# EAGLE design Croduino Nova v2.0 (EAGLE 7.3.0)

## Sheet 1 of 2
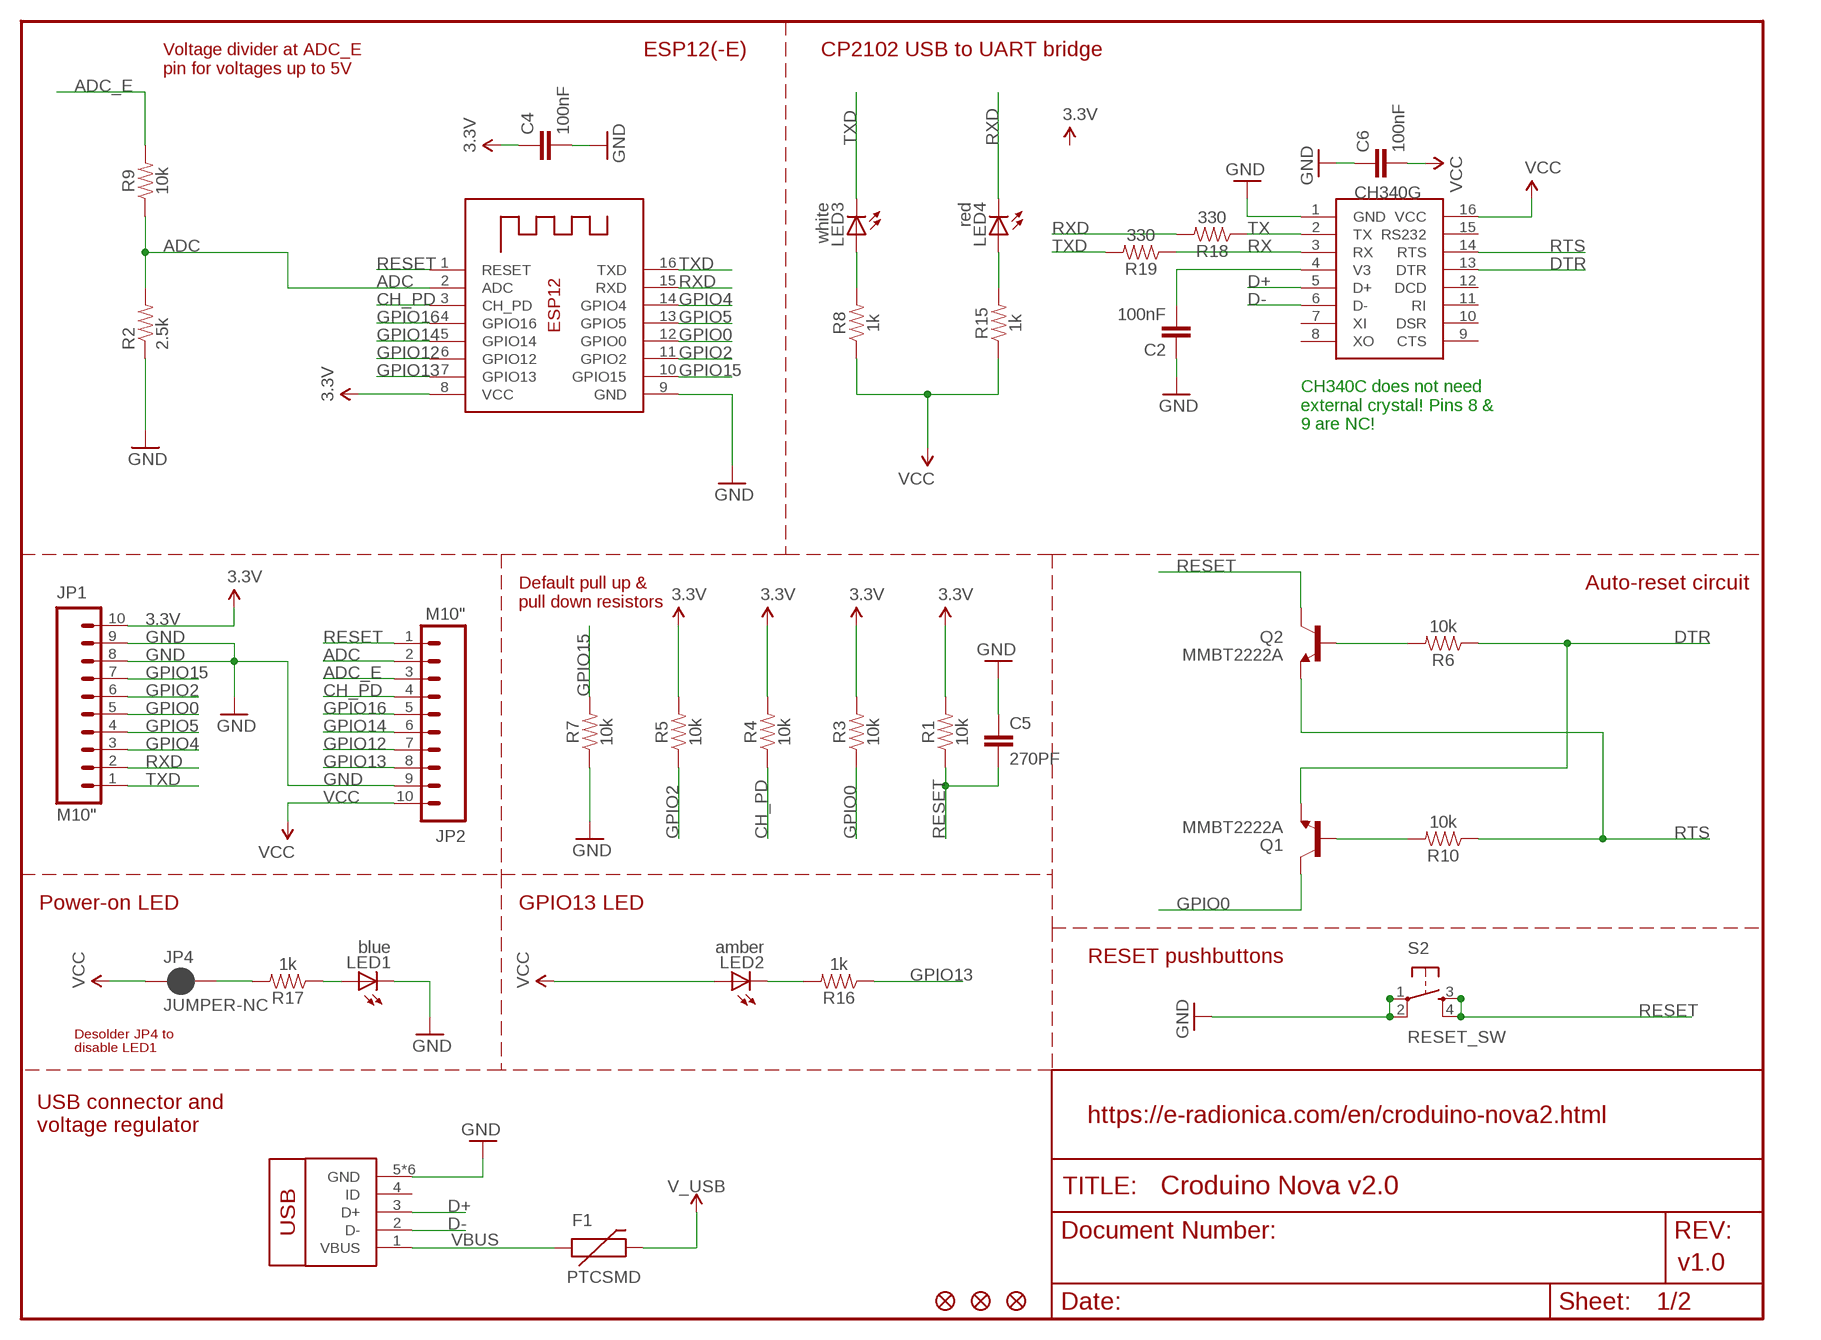
[diagram p0: schematic, sheet 1]

### Parts
C2  100nF  CAP0603-CAP  [0603-CAP]
C4  100nF  CAP0603-CAP  [0603-CAP]
C5  270PF  270PF-0603-50V-5%  [0603]
C6  100nF  CAP0603-CAP  [0603-CAP]
F1  PTCSMD  [PTC-1206]
JP1  M10"  [1X10]
JP2  M10"  [1X10]
JP3  FIDUCIAL1X2  [FIDUCIAL-1X2]
JP4  JUMPER-NC  JUMPER-SMT_2_NC_PASTE_NO-SILK  [SMT-JUMPER_2_NC_PASTE_NO-SILK]
JP5  FIDUCIAL1X2  [FIDUCIAL-1X2]
JP6  FIDUCIAL1X2  [FIDUCIAL-1X2]
LED1  blue  LEDCHIP-LED0805  [CHIP-LED0805]
LED2  amber  LEDCHIP-LED0805  [CHIP-LED0805]
LED3  white  LEDCHIP-LED0805  [CHIP-LED0805]
LED4  red  LEDCHIP-LED0805  [CHIP-LED0805]
Q1  MMBT2222A  TRANSISTOR_NPNSOT23-3  [SOT23-3]
Q2  MMBT2222A  TRANSISTOR_NPNSOT23-3  [SOT23-3]
R1  10k  10KOHM-0603-1/10W-1%  [0603]
R2  2.5k  RESISTOR0603-RES  [0603-RES]
R3  10k  10KOHM-0603-1/10W-1%  [0603]
R4  10k  10KOHM-0603-1/10W-1%  [0603]
R5  10k  10KOHM-0603-1/10W-1%  [0603]
R6  10k  10KOHM-0603-1/10W-1%  [0603]
R7  10k  10KOHM-0603-1/10W-1%  [0603]
R8  1k  1KOHM-0603-1/10W-1%  [0603]
R9  10k  10KOHM-0603-1/10W-1%  [0603]
R10  10k  10KOHM-0603-1/10W-1%  [0603]
R15  1k  1KOHM-0603-1/10W-1%  [0603]
R16  1k  1KOHM-0603-1/10W-1%  [0603]
R17  1k  1KOHM-0603-1/10W-1%  [0603]
R18  330  1KOHM-0603-1/10W-1%  [0603]
R19  330  1KOHM-0603-1/10W-1%  [0603]
S2  RESET_SW  TAC_SWITCHSMD  [TACTILE_SWITCH_SMD]
U$8  USB-MICRO  [U-F-M5DD-Y-L]
U$10  CH340C  CH340G  [SOIC16]
X1  ESP8266-12  ESP-12  [ESP-12]

### Nets
3.3V: C4.1 JP1.10 R1.2 R3.2 R4.2 R5.2 X1.8(VCC) ; also sheet 2
ADC: JP2.2 R2.2 R9.1 X1.2(ADC)
ADC_E: JP2.3 R9.2
CH_PD: JP2.4 R4.1 X1.3(CH_PD)
D+: U$8.3(D+) U$10.5(D+)
D-: U$8.2(D-) U$10.6(D-)
DTR: Q1.2(E) R6.1 U$10.13(DTR)
GND: C2.1 C4.2 C5.1 C6.1 JP1.8 JP1.9 JP2.9 LED1.C R2.1 R7.1 S2.1 S2.2 U$8.5(GND) U$8.PAD(GND) U$8.SHIELD1(GND) U$8.SHIELD2(GND) U$8.SHIELD3(GND) U$8.SHIELD4(GND) U$10.1(GND) X1.9(GND) ; also sheet 2
GPIO0: JP1.5 Q1.3(C) R3.1 X1.12(GPIO0)
GPIO2: JP1.6 R5.1 X1.11(GPIO2)
GPIO4: JP1.3 X1.14(GPIO4) ; also sheet 2
GPIO5: JP1.4 X1.13(GPIO5) ; also sheet 2
GPIO12: JP2.7 X1.6(GPIO12)
GPIO13: JP2.8 R16.1 X1.7(GPIO13)
GPIO14: JP2.6 X1.5(GPIO14)
GPIO15: JP1.7 R7.2 X1.10(GPIO15)
GPIO16: JP2.5 X1.4(GPIO16)
N$1: LED3.A R8.2
N$2: JP4.2 R17.2
N$3: LED1.A R17.1
N$4: LED4.A R15.2
N$5: LED2.C R16.2
N$7: C2.2 U$10.4(V3)
N$8: Q1.1(B) R10.2
N$11: Q2.1(B) R6.2
RESET: C5.2 JP2.1 Q2.3(C) R1.1 S2.3 S2.4 X1.1(RESET)
RTS: Q2.2(E) R10.1 U$10.14(RTS)
RX: R19.1 U$10.3(RX)
RXD: JP1.2 LED4.C R18.2 X1.15(RXD)
TX: R18.1 U$10.2(TX)
TXD: JP1.1 LED3.C R19.2 X1.16(TXD)
V_USB: F1.2 ; also sheet 2
VBUS: F1.1 U$8.1(VBUS)
VCC: C6.2 JP2.10 JP4.1 LED2.A R8.1 R15.1 U$10.16(VCC) ; also sheet 2
Unconnected: U$8.4(ID) U$10.7(XI) U$10.8(XO) U$10.9(CTS) U$10.10(DSR) U$10.11(RI) U$10.12(DCD) U$10.15(RS232)

### Notes on the sheet
- ESP12(-E) | CP2102 USB to UART bridge
- Voltage divider at ADC_E
  pin for voltages up to 5V
- CH340C does not need
  external crystal! Pins 8 &
  9 are NC!
- Auto-reset circuit
- Default pull up &
  pull down resistors
- Power-on LED | GPIO13 LED
- RESET pushbuttons
- Desolder JP4 to 
  disable LED1
- https://e-radionica.com/en/croduino-nova2.html
- USB connector and 
  voltage regulator
- v1.0

## Sheet 2 of 2
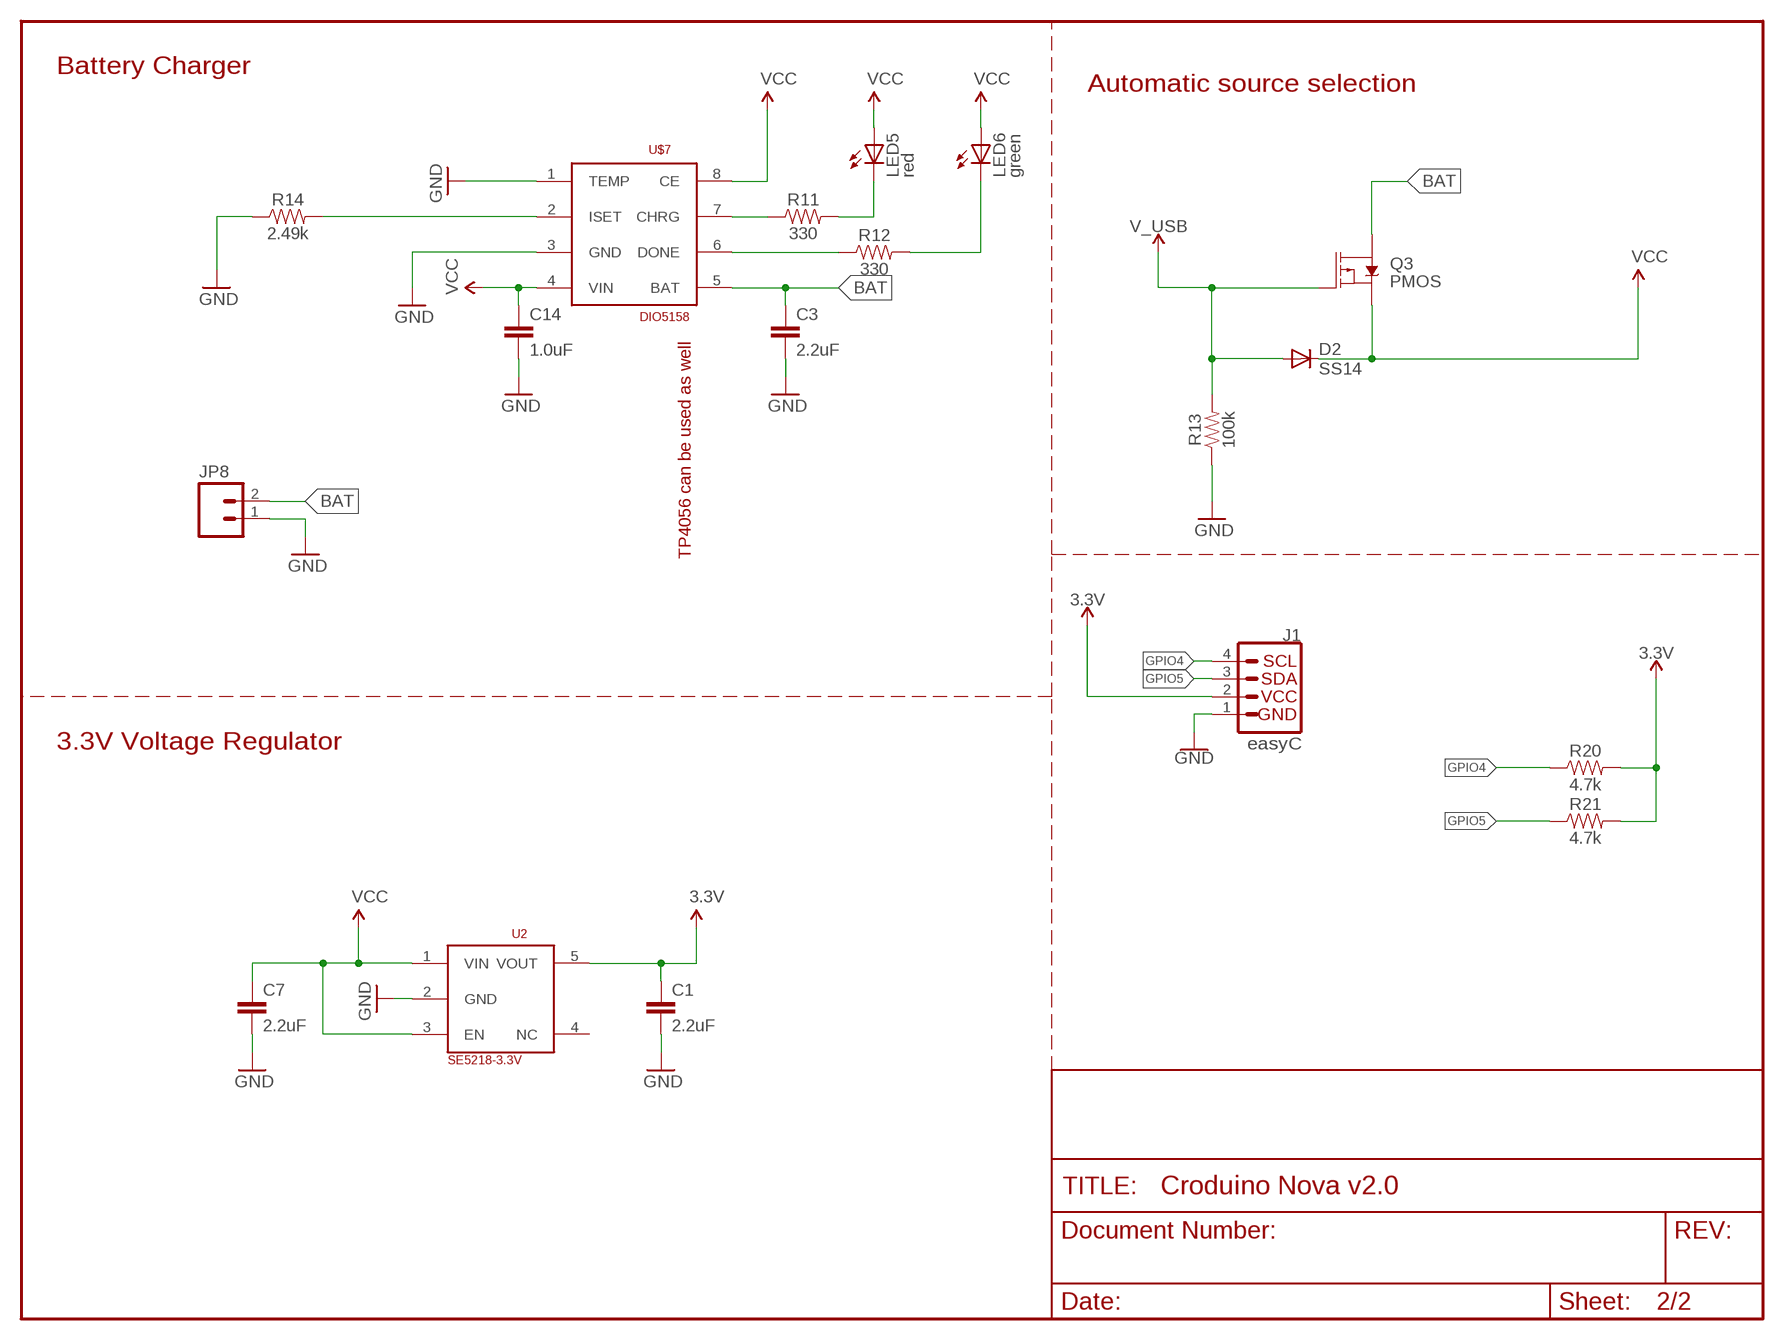
[diagram p1: schematic, sheet 2]

### Parts
C1  2.2uF  2.2UF-0603-10V-20%  [0603]
C3  2.2uF  2.2UF-0603-10V-20%  [0603]
C7  2.2uF  2.2UF-0603-10V-20%  [0603]
C14  1.0uF  1.0UF-0603-16V-10%  [0603]
D2  SS14  DIODE-DO-214AC  [DO-214AC]
J1  QWIIC_CONNECTORJS-1MM  [1X04_1MM_RA]
JP8  M02-JST-2MM-SMT  [JST-2-SMD]
LED5  red  LEDCHIP-LED0805  [CHIP-LED0805]
LED6  green  LEDCHIP-LED0805  [CHIP-LED0805]
Q3  PMOS  MOSFET_PCH-IRLML2244  [SOT23-3]
R11  330  150OHM-0603-1/10W-1%  [0603]
R12  330  150OHM-0603-1/10W-1%  [0603]
R13  100k  100KOHM-0603-1/10W-1%  [0603]
R14  2.49k  4.7KOHM-0603-1/10W-1%  [0603]
R20  4.7k  4.7KOHM-0603-1/10W-1%  [0603]
R21  4.7k  4.7KOHM-0603-1/10W-1%  [0603]
U2  SE5218-3.3V  SE5218  [SOT23-5]
U$7  DIO5158  [SOIC-8]

### Nets
3.3V: C1.1 J1.2 R20.2 R21.2 U2.5(VOUT) ; also sheet 1
BAT: C3.1 JP8.2 Q3.3(D) U$7.5(BAT)
CHRG: R11.1 U$7.7(CHRG)
DONE: R12.1 U$7.6(DONE)
GND: C1.2 C3.2 C7.2 C14.2 J1.1 JP8.1 R13.1 R14.1 U2.2(GND) U$7.1(TEMP) U$7.3(GND) ; also sheet 1
GPIO4: J1.4 R20.1 ; also sheet 1
GPIO5: J1.3 R21.1 ; also sheet 1
ISET: R14.2 U$7.2(ISET)
LED1: LED5.C R11.2
LED2: LED6.C R12.2
V_USB: D2.A Q3.1(G) R13.2 ; also sheet 1
VCC: C7.1 C14.1 D2.C LED5.A LED6.A Q3.2(S) U2.1(VIN) U2.3(EN) U$7.4(VIN) U$7.8(CE) ; also sheet 1
Unconnected: U2.4(NC)

### Notes on the sheet
- Battery Charger
- Automatic source selection
- TP4056 can be used as well
- 3.3V Voltage Regulator | easyC

## Library data of the parts
C1 C3 C7 = SparkFun-Capacitors:2.2UF: 2.2µF ceramic capacitors A capacitor is a passive two-terminal electrical component used to store electrical energy temporarily in an electric field.; PROD_ID: CAP-07888
C2 C4 C6 = SparkFun:CAP: Capacitor Standard 0603 ceramic capacitor, and 0.1" leaded capacitor.
C5 = SparkFun-Capacitors:270PF: 270pF/0.27nF ceramic capacitors A capacitor is a passive two-terminal electrical component used to store electrical energy temporarily in an electric field.; PROD_ID: CAP-13339
C14 = SparkFun-Capacitors:1.0UF: 1µF ceramic capacitors A capacitor is a passive two-terminal electrical component used to store electrical energy temporarily in an electric field.; PROD_ID: CAP-00868
D2 = diode:DIODE-: DIODE
F1 = SparkFun:PTC: Resettable Fuse PTC Resettable Fuse. Spark Fun Electronics SKU : COM-08357
J1 = SparkFun-Connectors:QWIIC_CONNECTOR: SparkFun I2C Standard Qwiic Connector An SMD 1mm pitch JST connector makes it easy and quick (get it? Qwiic?) to connect I2C devices to each other. The Qwiic system <http://www.sparkfun.com/qwiic> enables fast and solderless connection between popular platforms and various sensors and actuators. We carry 200mm <https://www.sparkfun.com/products/14204>, 100mm <https://www.sparkfun.com/products/14205>, 50mm <https://www.sparkfun.com/products/14206>, and breadboard friendly <https://www.sparkfun.com/products/14207> Qwiic cables. We also offer 10 pcs strips <https://www.sparkfun.com/products/14323> the SMD connectors.; PROD_ID: CONN-13694
JP1 JP2 = SparkFun:M10: Header 10 Standard 10-pin 0.1" header. Use with straight break away headers (SKU : PRT-00116), right angle break away headers (PRT-00553), swiss pins (PRT-00743), machine pins (PRT-00117), and female headers (PRT-00115).
JP3 JP5 JP6 = SparkFun:FIDUCIAL: Fiducial Alignment Points Various fiducial points for machine vision alignment.
JP4 = SparkFun-Jumpers:JUMPER-SMT_2_NC_PASTE: Normally closed solder jumper This jumper has an aperture in the stencil to allow solder paste to bridge the split in the wire so it's normally closed (NC). Wick off the solder to open the connection. Reapply solder to reclose the connection.
JP8 = SparkFun:M02: Header 2 Standard 2-pin 0.1" header. Use with straight break away headers (SKU : PRT-00116), right angle break away headers (PRT-00553), swiss pins (PRT-00743), machine pins (PRT-00117), and female headers (PRT-00115). Molex polarized connector foot print use with SKU : PRT-08233 with associated crimp pins and housings.
LED1-LED6 = adafruit:LED: LED OSRAM: - CHIPLED LG R971, LG N971, LY N971, LG Q971, LY Q971, LO R971, LY R971 LH N974, LH R974 LS Q976, LO Q976, LY Q976 LO Q996 - Hyper CHIPLED LW Q18S LB Q993, LB Q99A, LB R99A - SideLED LS A670, LO A670, LY A670, LG A670, LP A670 LB A673, LV A673, LT A673, LW A673 LH A674 LY A675 LS A676, LA A676, LO A676, LY A676, LW A676 LS A679, LY A679, LG A679 - Hyper Micro SIDELED® LS Y876, LA Y876, LO Y876, LY Y876 LT Y87S - SmartLED LW L88C, LW L88S LB L89C, LB L89S, LG L890 LS L89K, LO L89K, LY L89K LS L896, LA L896, LO L896, LY L896 - TOPLED LS T670, LO T670, LY T670, LG T670, LP T670 LSG T670, LSP T670, LSY T670, LOP T670, LYG T670 LG T671, LOG T671, LSG T671 LB T673, LV T673, LT T673, LW T673 LH T674 LS T676, LA T676, LO T676, LY T676, LB T676, LH T676, LSB T676, LW T676 LB T67C, LV T67C, LT T67C, LS T67K, LO T67K, LY T67K, LW E67C LS E67B, LA E67B, LO E67B, LY E67B, LB E67C, LV E67C, LT E67C LW T67C LS T679, LY T679, LG T679 LS T770, LO T770, LY T770, LG T770, LP T770 LB T773, LV T773, LT T773, LW T773 LH T774 LS E675, LA E675, LY E675, LS T675 LS T776, LA T776, LO T776, LY T776, LB T776 LHGB T686 LT T68C, LB T68C - Hyper Mini TOPLED® LB M676 - Mini TOPLED Santana® LG M470 LS M47K, LO M47K, LY M47K Source: http://www.osram.convergy.de/
Q1 Q2 = SparkFun:TRANSISTOR_NPN: Transistor NPN BJT configuration in SOT23 package. MMBT2222 is the common NPN we use. Double check BCE configuration again layout.
Q3 = SparkFun-DiscreteSemi:MOSFET_PCH: P-channel MOSFETs Voltage controlled devices that allow control of high current outputs. SparkFun Products: SparkFun ESP32 Thing <https://www.sparkfun.com/products/13907> SparkFun ESP8266 Thing <https://www.sparkfun.com/products/13231>; PROD_ID: TRANS-11153; VALUE: 4.3A/20V/54mΩ
R1 R3-R7 R9 R10 = SparkFun-Resistors:10KOHM: 10kΩ resistor A resistor is a passive two-terminal electrical component that implements electrical resistance as a circuit element. Resistors act to reduce current flow, and, at the same time, act to lower voltage levels within circuits. - Wikipedia; PROD_ID: RES-00824
R2 = SparkFun:RESISTOR: Resistor Basic schematic elements and footprints for 0603, 1206, and PTH resistors.
R8 R15-R17 = SparkFun-Resistors:1KOHM: 1kΩ resistor A resistor is a passive two-terminal electrical component that implements electrical resistance as a circuit element. Resistors act to reduce current flow, and, at the same time, act to lower voltage levels within circuits. - Wikipedia; PROD_ID: RES-07856
R11 R12 = SparkFun-Resistors:150OHM: 150Ω resistor A resistor is a passive two-terminal electrical component that implements electrical resistance as a circuit element. Resistors act to reduce current flow, and, at the same time, act to lower voltage levels within circuits. - Wikipedia; PROD_ID: RES-11028; VALUE: 150
R13 = SparkFun-Resistors:100KOHM: 100kΩ resistor A resistor is a passive two-terminal electrical component that implements electrical resistance as a circuit element. Resistors act to reduce current flow, and, at the same time, act to lower voltage levels within circuits. - Wikipedia; PROD_ID: RES-07828
R14 = SparkFun-Resistors:4.7KOHM: 4.7kΩ resistor A resistor is a passive two-terminal electrical component that implements electrical resistance as a circuit element. Resistors act to reduce current flow, and, at the same time, act to lower voltage levels within circuits. - Wikipedia; PROD_ID: RES-07857; VALUE: 4.7k
R18 R19 = SparkFun-Resistors:1KOHM: 1kΩ resistor A resistor is a passive two-terminal electrical component that implements electrical resistance as a circuit element. Resistors act to reduce current flow, and, at the same time, act to lower voltage levels within circuits. - Wikipedia; PROD_ID: RES-07856; VALUE: 1k
R20 R21 = SparkFun-Resistors:4.7KOHM: 4.7kΩ resistor A resistor is a passive two-terminal electrical component that implements electrical resistance as a circuit element. Resistors act to reduce current flow, and, at the same time, act to lower voltage levels within circuits. - Wikipedia; PROD_ID: RES-07857
S2 = SparkFun:TAC_SWITCH: Momentary Switch Button commonly used for reset or general input. Spark Fun Electronics SKU : COM-00097
U2 = ERADIONICA:SE5218
U$7 = ERADIONICA:DIO5158
U$8 = ERADIONICA:USB-MICRO
U$10 = ch340g:CH340G
X1 = adafruit:ESP-12

## Board
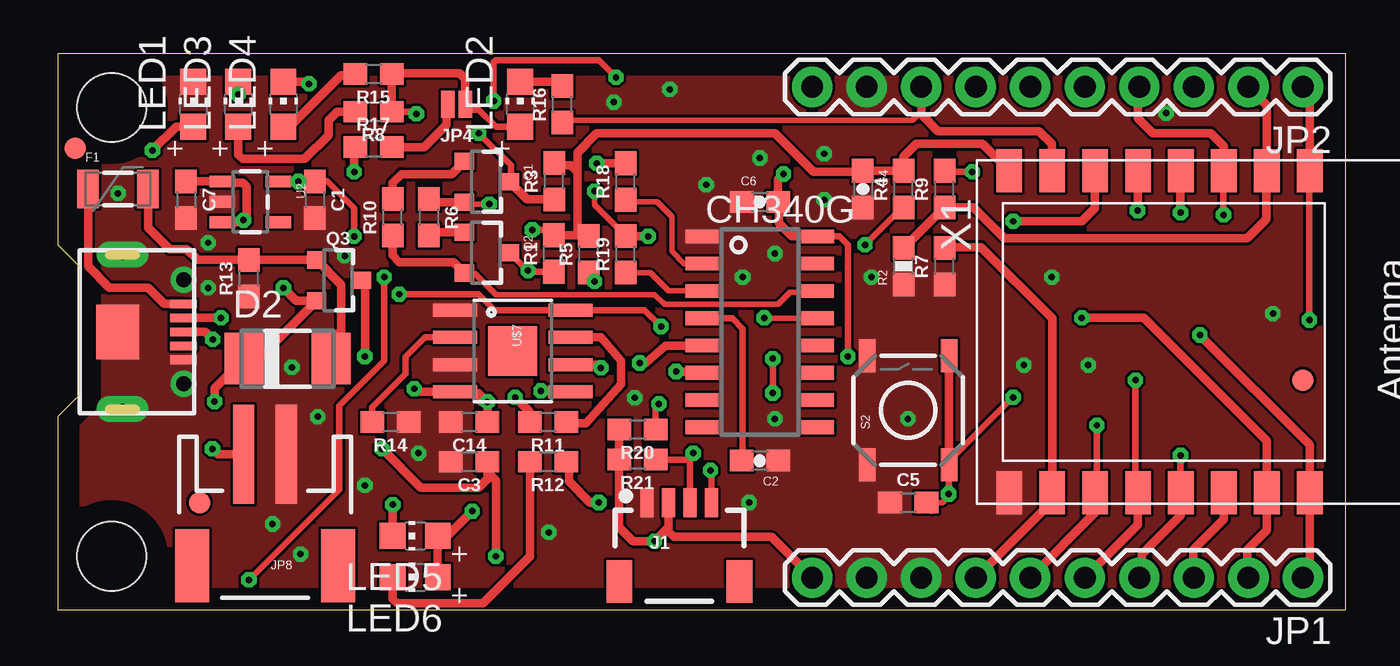
[diagram p2: board, top side]
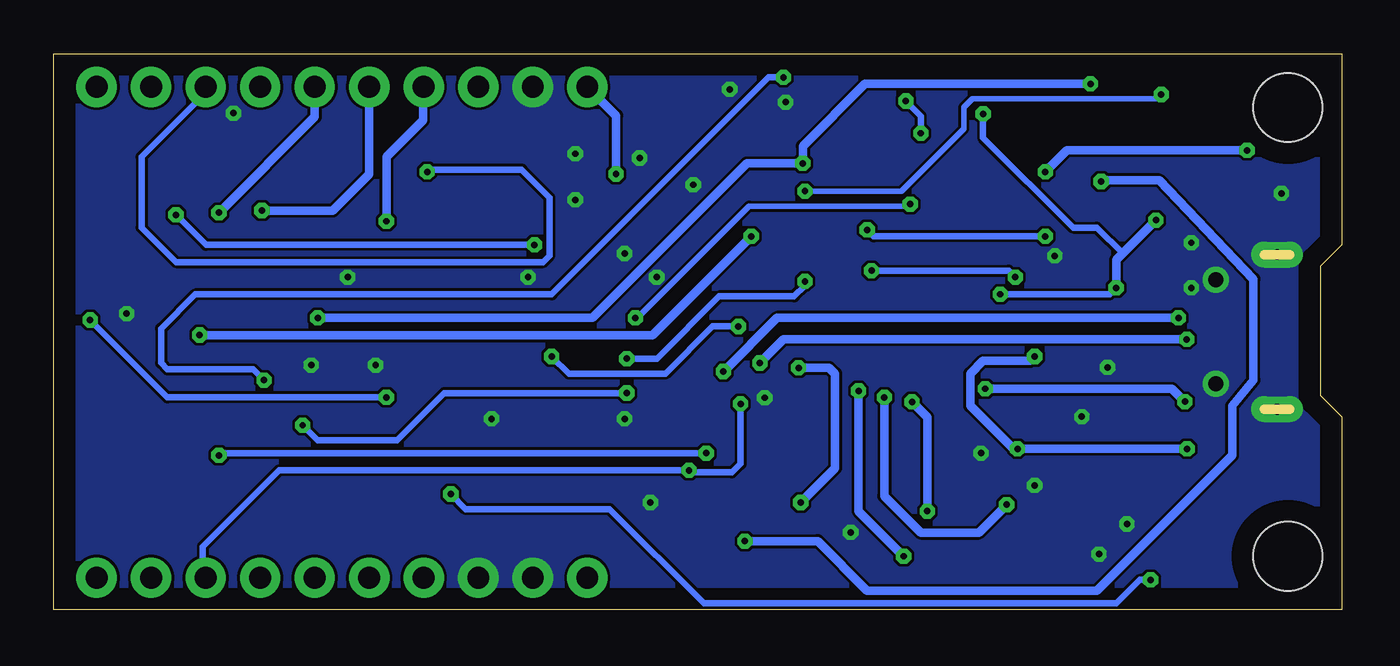
[diagram p3: board, bottom side, seen from below]

Size 60 x 25.9 mm. Coordinates in mm from the lower left corner, seen from the top.
Outline: 0,0 60,0 60,25.9 0,25.9 0,17 1,16 1,10 0,9 0,0
Copper layers (1*16): Top 0.035mm / dielectric 1.5mm / Bottom 0.035mm
Design rules "default *": minimum track width 10mil, minimum drill 24mil, track to track 5mil, track to pad 5mil, pad to pad 5mil, via to via 5mil, smd to smd 0mil, copper to edge 40mil, drill to drill 8mil, minimum pad ring 10mil, minimum via ring 8mil, stop-mask expansion 4mil, vias tented up to drill 0.6mm, thermal gap 10mil
Holes 3.2 mm at 2.5,23.4 2.5,2.5

### Footprints (pad centres in the part's own frame; a part is rotated, then mirrored left to right if it is on the bottom)
0603 = smd 1.1 x 1: 1 -0.85,0; 2 0.85,0
0603-CAP = smd 1.1 x 1: 1 -0.85,0; 2 0.85,0
DO-214AC = smd 1.8 x 2.4: A 2.025,0; C -2.025,0
PTC-1206 = smd 1 x 1.8: 1 -1.4,0; 2 1.4,0
1X04_1MM_RA = smd 0.6 x 1.35: 1 -1.5,0; 2 -0.5,0; 3 0.5,0; 4 1.5,0 | smd 1.2 x 2: NC1 2.8,-3.675; NC2 -2.8,-3.675
1X10 = drill 1.016 pad 1.88: 1 0,0; 2 2.54,0; 3 5.08,0; 4 7.62,0; 5 10.16,0; 6 12.7,0; 7 15.24,0; 8 17.78,0; 9 20.32,0; 10 22.86,0
FIDUCIAL-1X2 = smd 1 x 1: 1 0,0
SMT-JUMPER_2_NC_PASTE_NO-SILK = smd 0.635 x 1.27: 1 -0.406,0; 2 0.406,0
JST-2-SMD = smd 1 x 4.6: 1 -1,-3.7; 2 1,-3.7 | smd 1.6 x 3.4: NC1 -3.4,1.5; NC2 3.4,1.5
CHIP-LED0805 = smd 1.2 x 1.2: A 0,-1.05; C 0,1.05
SOT23-3 = smd 0.8 x 0.9: 1 -0.95,-1; 2 0.95,-1; 3 0,1.1
0603-RES = smd 1.1 x 1: 1 -0.85,0; 2 0.85,0
TACTILE_SWITCH_SMD = smd 1.524 x 0.762: 1 -2.54,1.905; 2 2.54,1.905; 3 -2.54,-1.905; 4 2.54,-1.905
SOT23-5 = smd 0.55 x 1.2: 1 -0.95,-1.3; 2 0,-1.3; 3 0.95,-1.3; 4 0.95,1.3; 5 -0.95,1.3
SOIC-8 = smd 0.61 x 2.057: 1 -2.07,-2.892; 2 -0.8,-2.892; 3 0.47,-2.892; 4 1.74,-2.892; 5 1.74,2.492; 6 0.47,2.492; 7 -0.8,2.492; 8 -2.07,2.492 | smd 2.286 x 2.286: EPAD -0.165,-0.2
U-F-M5DD-Y-L = smd 0.4 x 1.25: 1 1.3,0; 2 0.65,0; 3 0,0; 4 -0.655,0; 5 -1.3,0 | smd 2.54 x 2: PAD 0,3.06 | drill 0.7 pad 1.2: SHIELD1 2.425,0; SHIELD2 -2.425,0 | drill 0.5 pad 1.2 long: SHIELD3 -3.6,2.84; SHIELD4 3.6,2.84
SOIC16 = smd 0.635 x 1.524: 1 -4.445,-2.695; 2 -3.175,-2.695; 3 -1.905,-2.695; 4 -0.635,-2.695; 5 0.635,-2.695; 6 1.905,-2.695; 7 3.175,-2.695; 8 4.445,-2.695; 9 4.445,2.695; 10 3.175,2.695; 11 1.905,2.695; 12 0.635,2.695; 13 -0.635,2.695; 14 -1.905,2.695; 15 -3.175,2.695; 16 -4.445,2.695
ESP-12 = smd 2 x 1.2: 1 -7.5,4.5; 2 -7.5,2.5; 3 -7.5,0.5; 4 -7.5,-1.5; 5 -7.5,-3.5; 6 -7.5,-5.5; 7 -7.5,-7.5; 8 -7.5,-9.5; 9 7.5,-9.5; 10 7.5,-7.5; 11 7.5,-5.5; 12 7.5,-3.5; 13 7.5,-1.5; 14 7.5,0.5; 15 7.5,2.5; 16 7.5,4.5

### Placement (x,y rotation side)
C1  11.97,19.1 270 top
C2  32.7,6.95 180 top
C3  19.16,6.9 180 top
C4  37.5,19.6 270 top
C5  39.61,5 0 top
C6  32.7,19 0 top
C7  5.97,19.1 270 top
C14  19.16,8.75 180 top
D2  10.7,11.7 0 top
F1  2.79,19.6 0 top
J1  28.95,5 0 top
JP1  58,1.5 180 top
JP2  58,24.36 180 top
JP3  6.6,5 0 top
JP4  18.57,23.55 180 top
JP5  58,10.7 0 top
JP6  0.8,21.5 0 top
JP8  9.65,3.56 180 top
LED1  6.3,23.55 0 top
LED2  21.54,23.55 0 top
LED3  8.4,23.55 0 top
LED4  10.5,23.55 0 top
LED5  16.64,3.45 90 top
LED6  16.64,1.52 90 top
Q1  19.94,19.94 270 top
Q2  19.94,16.64 270 top
Q3  13.05,15.35 270 top
R1  23.09,16.6 90 top
R2  39.4,16 90 top
R3  23.12,19.97 90 top
R4  39.4,19.6 90 top
R5  24.74,16.57 90 top
R6  17.27,18.29 270 top
R7  41.3,16 90 top
R8  14.7,23.2 180 top
R9  41.3,19.6 90 top
R10  15.59,18.29 90 top
R11  22.83,8.75 180 top
R12  22.83,6.9 180 top
R13  8.9,15.45 90 top
R14  15.49,8.75 180 top
R15  14.7,24.95 180 top
R16  23.5,23.55 90 top
R17  14.7,21.55 0 top
R18  26.45,19.95 90 top
R19  26.45,16.57 90 top
R20  27,8.4 180 top
R21  27,7 180 top
S2  39.61,9.3 90 top
U2  8.97,19 270 top
U$1  [LOGO-3MM]  29.16,22.19 0 top
U$3  [OSH-3MM]  1.04,4.83 0 top
U$4  [E-R.IO-6MM]  27.67,20.25 0 top
U$5  [MADE-IN-CROATIA-10MM]  44.11,7.11 0 top
U$6  [EASYC]  25.4,0.1 90 top
U$7  21.39,11.89 270 top
U$8  5.85,12.95 90 top
U$9  [CRODUINO_NOVA_V2.0]  -0.6,0 0 top
U$10  32.7,12.95 270 top
X1  53.82,12.95 270 top

### Tracks (layer width: path | path; a pad name or v marks a point on that pad's centre or on a via)
3.3V  (via drill 0.3)
  Top 0.305: C1.1 12.55,19.95 13.8,18.7 v13.8,17.4 | v22.1,17.7 22.84,17.7 R1.2
  Top 0.406: U2.5 v11.2,19.95 C1.1 | JP1.10 33.24,3.4 28.7,3.4 28.45,3.65 J1.2 28.45,3.85 v27.8,3.2 26.8,3.2 26.15,3.85 R21.2 R20.2 | 24.2,17.7 24.2,17.5 24.3,17.4 24.7,17.4 24.65,17.45 R1.2 24.71,17.45 R5.2 24.48,17.42 24.2,17.7 | 24.2,17.7 24.2,20.4 | 24.2,20.4 23.9,20.7 23.24,20.7 R3.2 | X1.8 43.07,21.7 40,21.7 39.4,21.1 R4.2 C4.1 37.45,20.4 35.2,20.4 33.4,22.2 25.1,22.2 24.2,21.3 24.2,20.4
  Bottom 0.305: v13.8,17.4 21.8,17.4 v22.1,17.7
  Bottom 0.406: v27.8,3.2 24.4,3.2 22.1,0.9 11.4,0.9 5.1,7.2 5.1,9.5 4.1,10.7 4.1,15.4 8.5,20 11.15,20 v11.2,19.95
ADC
  Top 0.406: JP2.2 56.32,23.5 X1.2 56.3,20.43 56.3,18.2 55.4,17.3 44.1,17.3 42.65,18.75 R9.1 R2.2
ADC_E  (via drill 0.3)
  Top 0.305: v42.6,20.4 41.35,20.4 R9.2
  Bottom 0.305: JP2.3 52.92,24.08 55.9,21.1 55.9,17.8 54.3,16.2 37.2,16.2 36.9,16.5 36.9,19.2 38.2,20.5 42.5,20.5 v42.6,20.4
BAT  (via drill 0.3)
  Top 0.406: JP8.2 7.44,7.26 v7.2,7.5 | v14.3,11.8 14.3,15.2 Q3.3 | C3.1 20.01,6.4 | 20.01,6.4 20.01,6.11 19.6,5.7 16.9,5.7 v15.1,7.5 | U$7.5 22.55,10.15 v22.5,10.2 | v20.4,2.5 20.4,6.01 20.01,6.4
  Bottom 0.406: v7.2,7.5 v15.1,7.5 15.3,7.5 17.3,9.5 17.3,11 16.7,11.6 14.5,11.6 v14.3,11.8 | v22.5,10.2 22.5,4.6 v20.4,2.5
CH_PD  (via drill 0.3)
  Top 0.305: R4.1 39.35,18.75 v37.6,17 | v54.3,18.4 54.3,20.43 X1.3
  Top 0.406: X1.3 54.32,21.58 53.7,22.2 51,22.2 50.3,22.9 50.3,24.28 JP2.4
  Bottom 0.305: v37.6,17 52.9,17 v54.3,18.4
CHRG
  Top 0.406: U$7.7 25.3,12.7 26.23,11.6 26.23,10.5 24.6,8.7 23.73,8.7 R11.1
D+  (via drill 0.3)
  Top 0.406: U$8.3 6.86,12.95 v7.21,12.6 | v27.1,11.5 27.4,11.5 28.3,12.3 29.99,12.3 U$10.5
  Bottom 0.406: v7.21,12.6 26,12.6 v27.1,11.5
D-  (via drill 0.3)
  Top 0.406: U$8.2 v7.6,13.6 | v28.8,11.1 29.95,11.1 U$10.6
  Bottom 0.406: v7.6,13.6 26.3,13.6 v28.8,11.1
DONE  (via drill 0.3)
  Top 0.406: U$7.6 25.15,11.43 v25.3,11.28 | v25.2,5 24.8,5 23.8,6 23.8,6.78 R12.1
  Bottom 0.406: v25.3,11.28 23.88,11.28 23.6,11 23.6,6.6 v25.2,5
DTR  (via drill 0.3)
  Top 0.254: U$10.13 32.91,13.59 v32.9,13.6 | v20.1,18.9 19.03,18.9 Q1.2
  Top 0.406: Q1.2 17.42,18.99 R6.1
  Bottom 0.254: v32.9,13.6 32.8,13.6 27.6,18.8 20.2,18.8 v20.1,18.9
GND  (via drill 0.3)
  other vias: 16.8,7.3 14.3,5.8 11.3,2.6 45,11.4 48,11.4 56.6,13.8 37.9,15.5 35.7,19.1 30.2,19.8 32.7,21.05 7,15 7,17.1 33.4,16.6 31.9,15.5 2.8,19.4 10,4 12.1,9 10.9,11.3 32.2,5 22.86,3.62 39.6,8.9 33.4,8.9 46.3,15.5 35.7,21.25 28.5,24.25 25.9,23.64 13.36,16.49 51.62,23.14 26.87,9.88
  pour Top (rank 6, no thermals): 0,0 60,0 60,25.9 0,25.9
  pour Bottom (rank 6, no thermals): 0,0 60,0 60,25.9 0,25.9
GPIO0  (via drill 0.3)
  Top 0.305: R3.1 21.78,19.12 21.1,19.8 21.1,20.7 v19.6,22.2 | v20.3,23.7 20.3,25.5 20.4,25.6 25.2,25.6 v26,24.8 | v50.2,10.7 50.2,5.57 X1.12
  Top 0.406: X1.12 50.32,3.98 JP1.5 | R3.1 21.86,19.12 Q1.3
  Bottom 0.305: v19.6,22.2 19.6,23 v20.3,23.7 | v26,24.8 26.7,24.8 36.8,14.7 53.4,14.7 55,13.1 55,11.5 54.7,11.2 50.7,11.2 v50.2,10.7
GPIO2  (via drill 0.3)
  Top 0.305: R5.1 24.74,15.56 v25,15.3 | v33.3,11.7 v33.3,10.1 | v48.4,8.6 48.4,5.53 X1.11
  Top 0.406: X1.11 48.32,4.52 JP1.6
  Bottom 0.305: v25,15.3 25,15.1 25.5,14.6 29,14.6 31.9,11.7 v33.3,11.7 | v33.3,10.1 41.8,10.1 44,7.9 47.7,7.9 v48.4,8.6
GPIO4  (via drill 0.3)
  Top 0.305: J1.4 30.45,6.45 v30.4,6.5 | R20.1 27.85,9.45 v28,9.6
  Top 0.406: X1.14 54.32,4.22 52.9,2.8 52.9,1.52 JP1.3
  Bottom 0.305: JP1.3 53.05,1.63 53.05,2.95 49.5,6.5 v30.4,6.5 30.3,6.4 28.4,6.4 28,6.8 v28,9.6
GPIO5  (via drill 0.3)
  Top 0.305: J1.3 29.45,7.15 v29.6,7.3 29.3,7 R21.1 | v52.3,7.2 52.3,5.47 X1.13
  Top 0.406: X1.13 52.32,4.42 50.5,2.6 50.5,1.62 JP1.4
  Bottom 0.305: v29.6,7.3 52.2,7.3 v52.3,7.2
GPIO12  (via drill 0.3)
  Top 0.406: X1.6 48.32,18.72 47.7,18.1 v44.5,18.1
  Bottom 0.406: v44.5,18.1 44.5,21.1 42.8,22.8 42.8,23.8 42.9,23.9 42.9,24.22 JP2.7
GPIO13
  Top 0.254: JP2.8 40.22,23.22 39.8,22.8 23.6,22.8 R16.1
  Top 0.406: JP2.8 40.22,23.08 41,22.3 45.7,22.3 46.3,21.7 46.3,20.47 X1.7
GPIO14  (via drill 0.3)
  Top 0.406: v50.3,18.6 50.3,20.43 X1.5
  Bottom 0.406: JP2.6 45.3,20.3 47,18.6 v50.3,18.6
GPIO15
  Top 0.406: JP1.7 46.32,5.06 X1.10 46.32,13.58 43,16.9 41.35,16.9 R7.2
GPIO16  (via drill 0.3)
  Top 0.406: v52.3,18.5 52.3,20.43 X1.4
  Bottom 0.406: JP2.5 47.84,22.96 v52.3,18.5
ISET
  Top 0.305: R14.2 14.64,9.44 16.2,11 16.2,11.8 17.1,12.7 U$7.2
  Top 0.406: 14.6,8.79 R14.2 | U$7.2
LED1  (via drill 0.3)
  Top 0.406: R11.2 21.98,9.22 v21.3,9.9 | v15.6,4.9 LED5.C
  Bottom 0.406: v21.3,9.9 21.3,5.3 19.6,3.6 16.9,3.6 v15.6,4.9
LED2
  Top 0.406: LED6.C 15.59,0.51 15.8,0.3 19.8,0.3 22,2.5 22,6.88 R12.2
N$1
  Top 0.406: LED3.A 8.4,21.2 8.6,21 11.5,21 12.6,22.1 12.6,22.8 13,23.2 R8.2
N$2
  Top 0.406: R17.2 17.05,21.55 18.1,22.6 18.1,23.49 JP4.2
N$3  (via drill 0.3)
  Top 0.406: LED1.A 5.5,22.5 v4.4,21.4 | v13.8,20.4 13.8,21.5 R17.1
  Bottom 0.406: v4.4,21.4 12.8,21.4 v13.8,20.4
N$4
  Top 0.406: LED4.A 10.8,22.5 13.2,24.9 13.8,24.9 R15.2
N$5
  Top 0.406: LED2.C 23.3,24.6 R16.2
N$7
  Top 0.305: U$10.4 31.41,13.59 31.9,13.1 31.9,7 C2.2
N$8
  Top 0.406: R10.2 15.59,19.89 16,20.3 18.35,20.3 Q1.1
N$11
  Top 0.406: Q2.1 17.42,17.59 R6.2
RESET  (via drill 0.3)
  Top 0.254: R1.1 21.93,15.75 Q2.3 | v41.5,5.4 41.5,5.3 41.2,5 C5.2 40.7,4.6
  Top 0.305: v44.5,9.9 41.52,6.92 S2.3 41.5,6.74 v41.5,5.4 | v58.3,13.5 58.3,20.43 X1.1 | R1.1 21.95,15.75 v21.9,15.8 | v15.2,15.5 15.2,11.6 13.1,9.5 13.1,5.6 v8.9,1.4
  Top 0.406: X1.1 58.32,24.04 JP2.1 | S2.3 S2.4
  Bottom 0.305: v44.5,9.9 54.7,9.9 v58.3,13.5 | v21.9,15.8 15.5,15.8 v15.2,15.5 | v8.9,1.4 9.4,1.4 10.5,0.3 29.7,0.3 34.1,4.7 40.8,4.7 v41.5,5.4
RTS
  Top 0.254: Q2.2 19.41,15.69 20.4,14.67 27.8,14.67 28.2,14.3 28.21,14.3 28.27,14.24 33.55,14.24 34.1,14.8 35.34,14.8 U$10.14
  Top 0.406: R10.1 15.59,16.51 15.9,16.2 18.43,16.2 Q2.2
RX
  Top 0.254: U$10.3 28.45,14.86 27.6,15.7 26.47,15.7 R19.1
RXD  (via drill 0.3)
  Top 0.406: JP1.2 55.4,1.56 55.4,2.8 56.32,3.72 X1.15 56.32,7.88 50.6,13.6 v47.7,13.6 | v25.1,20.8 R18.2 | LED4.C 11.6,24.6 v11.7,24.5
  Bottom 0.406: v47.7,13.6 34.9,13.6 27.7,20.8 v25.1,20.8 25.1,21.6 22.2,24.5 v11.7,24.5
TX
  Top 0.254: U$10.2 29.18,16.12 28.6,16.7 28.6,18.3 27.9,19 26.55,19 R18.1
TXD  (via drill 0.3)
  Top 0.254: v25,19.5 25,18.87 R19.2 | v8.4,24 LED3.C
  Top 0.406: JP1.1 58.32,1.82 X1.16 58.32,7.68 v53.2,12.8 | v27.5,17.4 26.47,17.4 R19.2 | LED3.C 8.4,24.9
  Bottom 0.254: v25,19.5 20.5,19.5 17.6,22.4 17.6,23.4 17.2,23.8 8.6,23.8 v8.4,24
  Bottom 0.406: v53.2,12.8 32.1,12.8 v27.5,17.4
V_USB
  Top 0.406: D2.A 12.72,12.53 13.2,13 13.2,15.15 Q3.1 R13.2 6.5,16.3 6,16.8 5.2,16.8 4.2,17.8 F1.2
VBUS
  Top 0.406: U$8.1 4.95,14.25 4.2,15 2.4,15 1.4,16 F1.1
VCC  (via drill 0.3)
  Top 0.305: R8.1 16.6,23.2 v16.7,23.1 | LED2.A 20.4,22.5 19.6,23.3 19.22,23.3 JP4.1 | v28.1,13.2 27.34,13.96 U$7.8 20.34,13.96 19.6,14.7 v15.9,14.7 | v36.8,11.8 36.8,17 36.4,17.4 U$10.16
  Top 0.406: C7.1 U2.1 7.72,19.9 8.6,19.9 8.8,19.7 8.8,18.3 v8.65,18.15 8.55,18.05 U2.3 | R8.1 R15.1 15.6,25 18.7,25 18.97,24.73 JP4.1 19.02,23.5 | LED6.A LED5.A 18.15,3.45 v19.3,4.6 | U$10.16 34.2,17.39 33.6,18 33.6,18.95 C6.2 33.55,20.05 v33.8,20.3 | C14.1 v20.01,9.69 | v20.01,9.69 19.6,10.1 19.3,10.1 | 19.3,10.1 18.55,10.1 U$7.4 16.75,10.15 v16.6,10.3 | v7.3,9.7 7.3,10.32 D2.C 9.35,11.7 Q3.2 11.1,14.4 v10.5,15 | v20.01,9.69 19.71,9.69 19.3,10.1
  Bottom 0.305: v16.7,23.1 16.7,22 12.5,17.8 11.4,17.8 10.2,16.6 | v28.1,13.2 29.3,13.2 31.5,11 36,11 v36.8,11.8 | v15.9,14.7 10.8,14.7 v10.5,15
  Bottom 0.406: v16.6,10.3 7.9,10.3 v7.3,9.7 | v19.3,4.6 19.3,8.98 v20.01,9.69 | v33.8,20.3 33.8,23.02 JP2.10 | v10.5,15 10.5,16.3 10.2,16.6 v8.65,18.15

### Text on the board
200bmp: VIN | 5V | gnd | 13 | 12 | 14 | 16 | EN | A_e | A | rst | pwr | tx | rx | 13 | v2.0 FINAL | Croduino Nova / e-radionica.com / v2 | RESET | ESP12-E | gnd | gnd | 15 | 2 | 0 | 4 | 5 | 3 | 1 | CHRG | 3V3 | rx | tx | DONE
207bmp: PROTOTYPE / 7/2018